# EAGLE design TestBench (EAGLE 6.1)
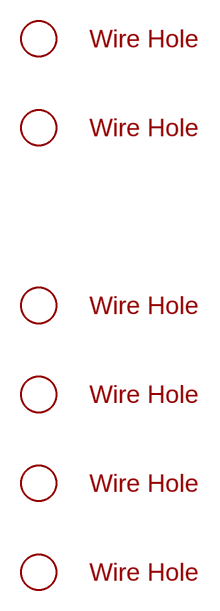
[diagram p0: schematic, sheet 1, part 1 of 2]
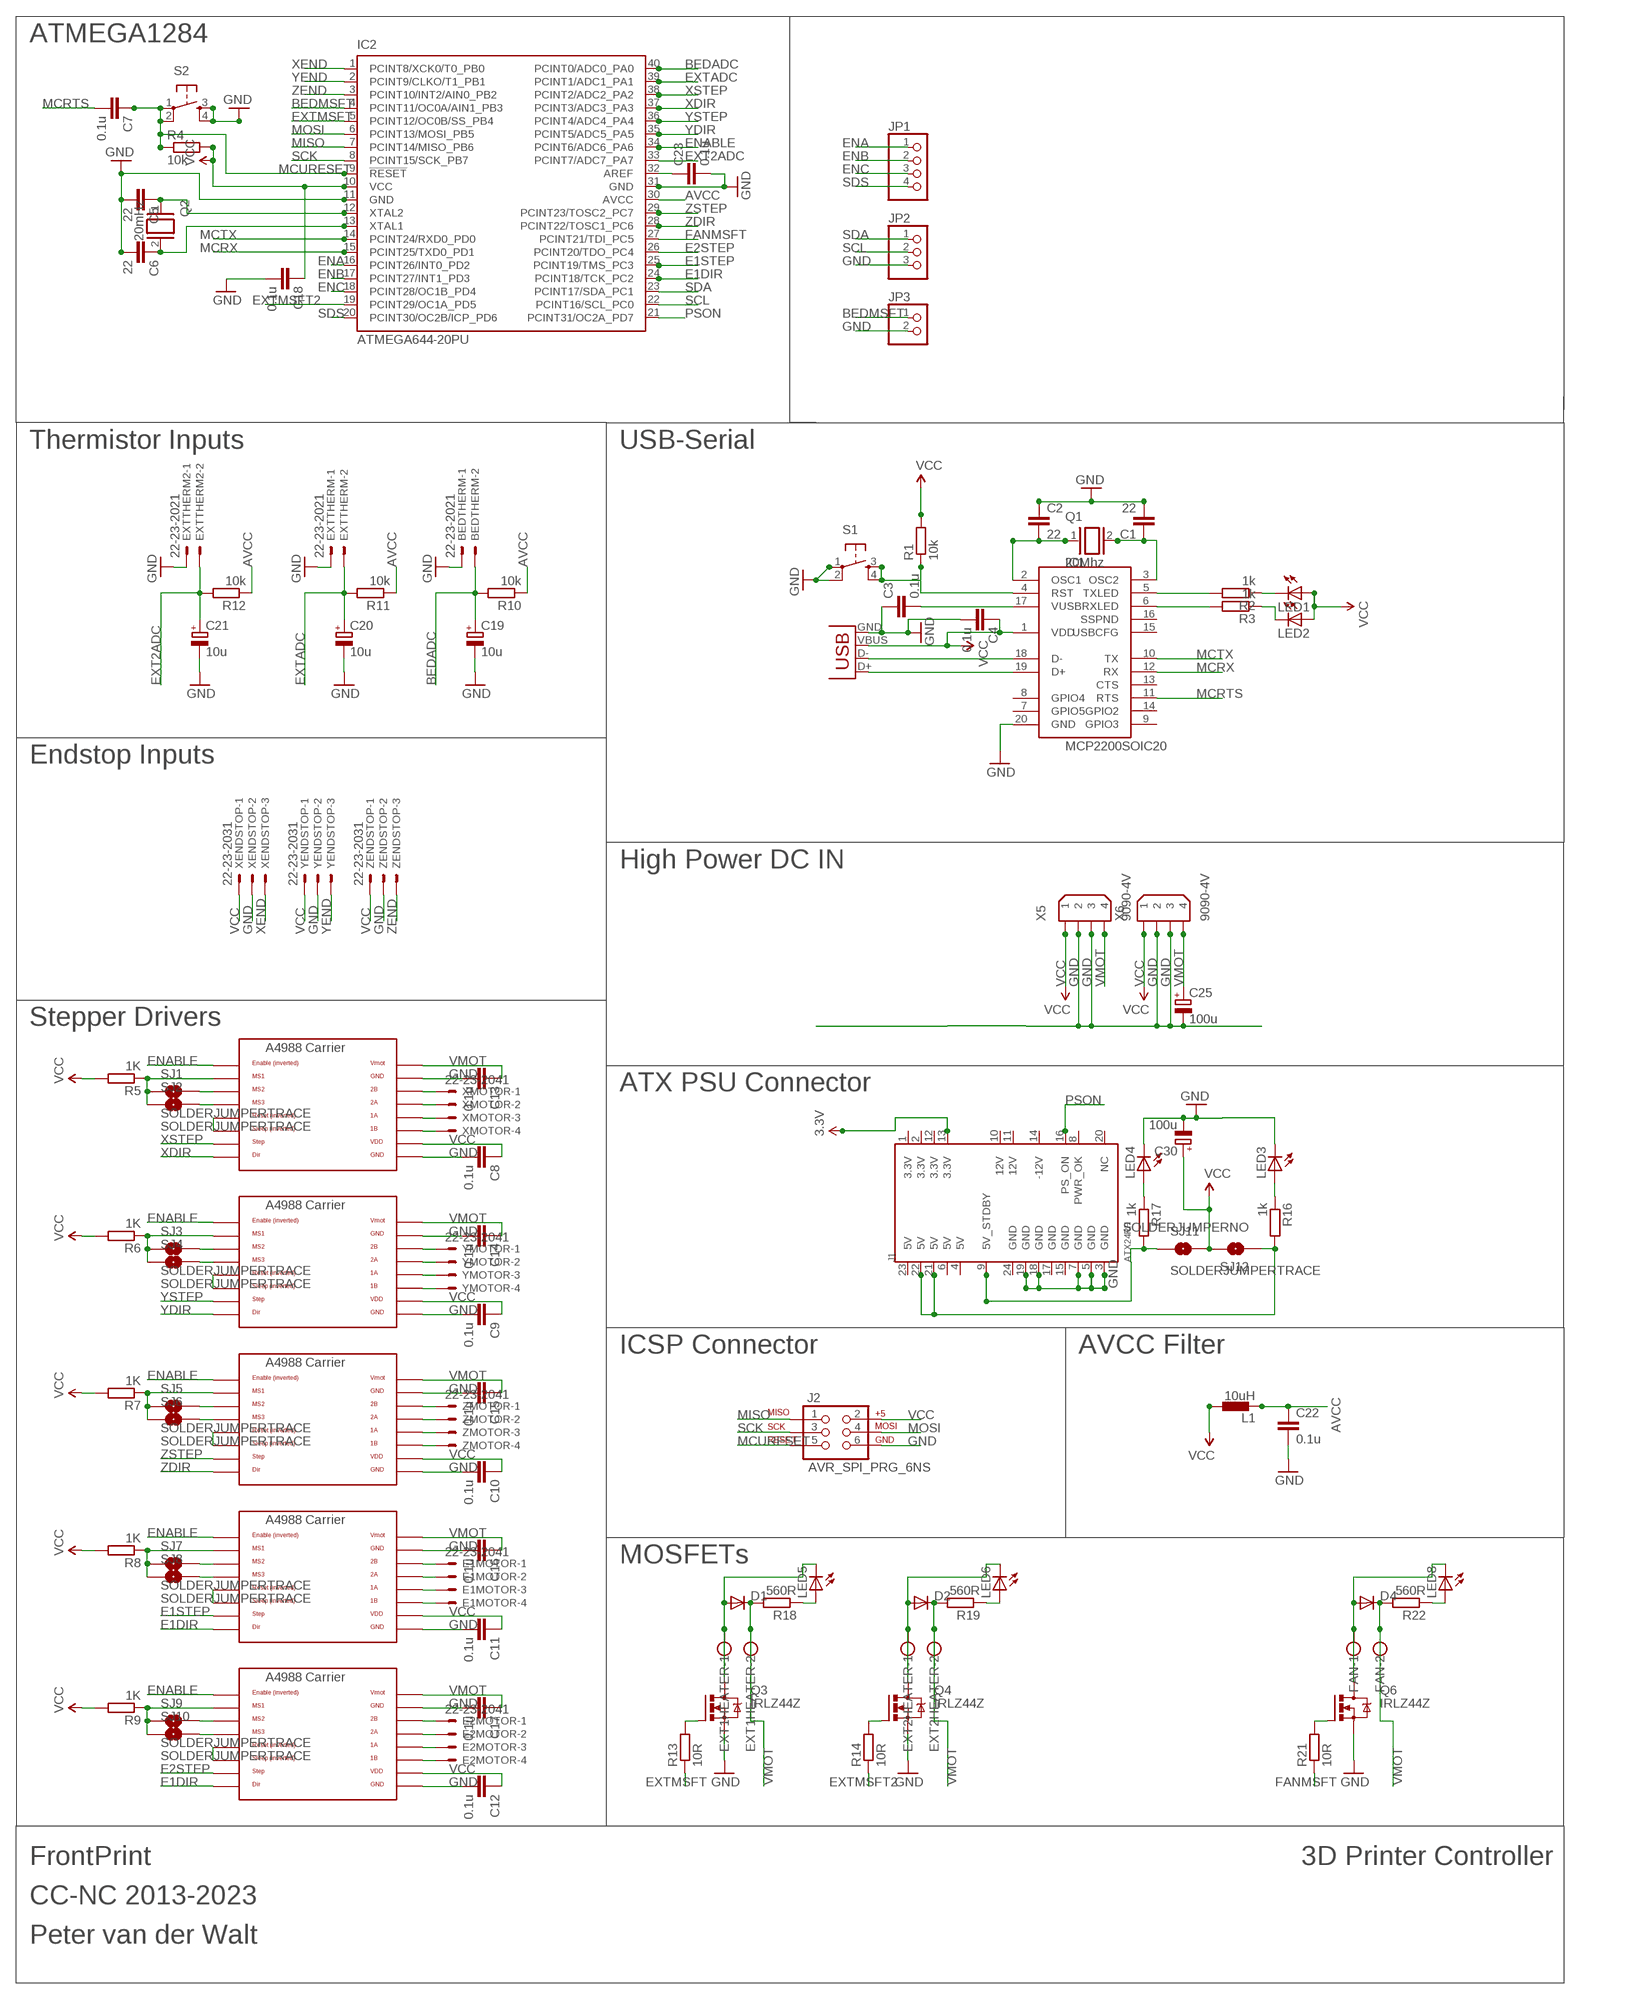
[diagram p1: schematic, sheet 1, part 2 of 2]

## Parts
BEDTHERM  22-23-2021  [22-23-2021]
C1  22  CAPKIT  [CAP-PTH-SMALL-KIT]
C2  22  CAPKIT  [CAP-PTH-SMALL-KIT]
C3  0.1u  CAPKIT  [CAP-PTH-SMALL-KIT]
C4  0.1u  CAPKIT  [CAP-PTH-SMALL-KIT]
C5  22  CAPKIT  [CAP-PTH-SMALL-KIT]
C6  22  CAPKIT  [CAP-PTH-SMALL-KIT]
C7  0.1u  CAPKIT  [CAP-PTH-SMALL-KIT]
C8  0.1u  CAPKIT  [CAP-PTH-SMALL-KIT]
C9  0.1u  CAPKIT  [CAP-PTH-SMALL-KIT]
C10  0.1u  CAPKIT  [CAP-PTH-SMALL-KIT]
C11  0.1u  CAPKIT  [CAP-PTH-SMALL-KIT]
C12  0.1u  CAPKIT  [CAP-PTH-SMALL-KIT]
C13  0.1u  CAPKIT  [CAP-PTH-SMALL-KIT]
C14  0.1u  CAPKIT  [CAP-PTH-SMALL-KIT]
C15  0.1u  CAPKIT  [CAP-PTH-SMALL-KIT]
C16  0.1u  CAPKIT  [CAP-PTH-SMALL-KIT]
C17  0.1u  CAPKIT  [CAP-PTH-SMALL-KIT]
C18  0.1u  CAPKIT  [CAP-PTH-SMALL-KIT]
C19  10u  CPOL-EUE2.5-5  [E2,5-5]
C20  10u  CPOL-EUE2.5-5  [E2,5-5]
C21  10u  CPOL-EUE2.5-5  [E2,5-5]
C22  0.1u  CAPKIT  [CAP-PTH-SMALL-KIT]
C23  0.1u  CAPKIT  [CAP-PTH-SMALL-KIT]
C25  100u  CPOL-EUE5-8.5  [E5-8,5]
C30  100u  CPOL-EUE5-8.5  [E5-8,5]
D1  DIODE1N4148  [DIODE-1N4148]
D2  DIODE1N4148  [DIODE-1N4148]
D4  DIODE1N4148  [DIODE-1N4148]
E1MOTOR  22-23-2041  [22-23-2041]
E2MOTOR  22-23-2041  [22-23-2041]
EPOLOLU  POLOLU_A4983CARRIER  [A4988BREAKOUT]
EPOLOLU2  POLOLU_A4983CARRIER  [A4988BREAKOUT]
EXT1HEATER  W237-102  [W237-102]
EXT2HEATER  W237-102  [W237-102]
EXTTHERM  22-23-2021  [22-23-2021]
EXTTHERM2  22-23-2021  [22-23-2021]
FAN  W237-102  [W237-102]
IC1  MCP2200SOIC20  [SOIC20]
IC2  ATMEGA644-20PU  [DIL40]
J1  ATX24RH  [ATX24_RIGHT_ANGLE]
J2  AVR_SPI_PRG_6NS  [2X3-NS]
JP1  PINHD-1X4  [1X04]
JP2  PINHD-1X3  [1X03]
JP3  PINHD-1X2  [1X02]
L1  10uH  BL01RN1A  [BL01RN1A]
LED1  LED3MM  [LED3MM]
LED2  LED3MM  [LED3MM]
LED3  LED3MM  [LED3MM]
LED4  LED3MM  [LED3MM]
LED5  LED3MM  [LED3MM]
LED6  LED3MM  [LED3MM]
LED8  LED3MM  [LED3MM]
Q1  20Mhz  XTAL/S  [QS]
Q2  20mHz  XTAL/S  [QS]
Q3  IRLZ44Z  [TO220BH]
Q4  IRLZ44Z  [TO220BH]
Q6  IRLZ44Z  [TO220BH]
R1  10k  R-EU_0204/7  [0204/7]
R2  1k  R-EU_0204/7  [0204/7]
R3  1k  R-EU_0204/7  [0204/7]
R4  10k  R-EU_0204/7  [0204/7]
R5  1K  R-EU_0204/7  [0204/7]
R6  1K  R-EU_0204/7  [0204/7]
R7  1K  R-EU_0204/7  [0204/7]
R8  1K  R-EU_0204/7  [0204/7]
R9  1K  R-EU_0204/7  [0204/7]
R10  10k  R-EU_0204/7  [0204/7]
R11  10k  R-EU_0204/7  [0204/7]
R12  10k  R-EU_0204/7  [0204/7]
R13  10R  R-EU_0204/7  [0204/7]
R14  10R  R-EU_0204/7  [0204/7]
R16  1k  R-EU_0204/7  [0204/7]
R17  1k  R-EU_0204/7  [0204/7]
R18  560R  R-EU_0204/7  [0204/7]
R19  560R  R-EU_0204/7  [0204/7]
R21  10R  R-EU_0204/7  [0204/7]
R22  560R  R-EU_0204/7  [0204/7]
S1  TAC_SWITCHPTH  [TACTILE-PTH]
S2  TAC_SWITCHPTH  [TACTILE-PTH]
SJ1  SOLDERJUMPERTRACE  [SJ_2S-TRACE]
SJ2  SOLDERJUMPERTRACE  [SJ_2S-TRACE]
SJ3  SOLDERJUMPERTRACE  [SJ_2S-TRACE]
SJ4  SOLDERJUMPERTRACE  [SJ_2S-TRACE]
SJ5  SOLDERJUMPERTRACE  [SJ_2S-TRACE]
SJ6  SOLDERJUMPERTRACE  [SJ_2S-TRACE]
SJ7  SOLDERJUMPERTRACE  [SJ_2S-TRACE]
SJ8  SOLDERJUMPERTRACE  [SJ_2S-TRACE]
SJ9  SOLDERJUMPERTRACE  [SJ_2S-TRACE]
SJ10  SOLDERJUMPERTRACE  [SJ_2S-TRACE]
SJ11  SOLDERJUMPERTRACE  [SJ_2S-TRACE]
SJ12  SOLDERJUMPERNO  [SJ_2S-NO]
U$1  3MMHOLE  [3MMHOLE]
U$3  3MMHOLE  [3MMHOLE]
U$5  3MMHOLE  [3MMHOLE]
U$6  3MMHOLE  [3MMHOLE]
U$7  3MMHOLE  [3MMHOLE]
U$8  3MMHOLE  [3MMHOLE]
X1  USBPTH  [USB-B-PTH]
X5  9090-4V  [9090-4V]
X6  9090-4V  [9090-4V]
XENDSTOP  22-23-2031  [22-23-2031]
XMOTOR  22-23-2041  [22-23-2041]
XPOLOLU  POLOLU_A4983CARRIER  [A4988BREAKOUT]
YENDSTOP  22-23-2031  [22-23-2031]
YMOTOR  22-23-2041  [22-23-2041]
YPOLOLU  POLOLU_A4983CARRIER  [A4988BREAKOUT]
ZENDSTOP  22-23-2031  [22-23-2031]
ZMOTOR  22-23-2041  [22-23-2041]
ZPOLOLU  POLOLU_A4983CARRIER  [A4988BREAKOUT]

## Nets
3.3V: J1.13(3.3V)
AVCC: C22.1 IC2.30(AVCC) L1.1 R10.1 R11.1 R12.1
BEDADC: BEDTHERM.2 C19.+ IC2.40(PCINT0/ADC0_PA0) R10.2
BEDMSFT: IC2.4(PCINT11/OC0A/AIN1_PB3) JP3.1
E1DIR: EPOLOLU2.DIR EPOLOLU.DIR IC2.24(PCINT18/TCK_PC2)
E1STEP: EPOLOLU.STEP IC2.25(PCINT19/TMS_PC3)
E2STEP: EPOLOLU2.STEP IC2.26(PCINT20/TDO_PC4)
ENA: IC2.16(PCINT26/INT0_PD2) JP1.1
ENABLE: EPOLOLU2.EN EPOLOLU.EN IC2.34(PCINT6/ADC6_PA6) XPOLOLU.EN YPOLOLU.EN ZPOLOLU.EN
ENB: IC2.17(PCINT27/INT1_PD3) JP1.2
ENC: IC2.18(PCINT28/OC1B_PD4) JP1.3
EXT2ADC: C21.+ EXTTHERM2.2 IC2.33(PCINT7/ADC7_PA7) R12.2
EXTADC: C20.+ EXTTHERM.2 IC2.39(PCINT1/ADC1_PA1) R11.2
EXTMSFT: IC2.5(PCINT12/OC0B/SS_PB4) R13.1
EXTMSFT2: IC2.19(PCINT29/OC1A_PD5) R14.1
FANMSFT: IC2.27(PCINT21/TDI_PC5) R21.1
GND: BEDTHERM.1 C1.2 C2.1 C3.1 C4.2 C5.2 C6.2 C8.2 C9.2 C10.2 C11.2 C12.2 C13.2 C14.2 C15.2 C16.2 C17.2 C18.2 C19.- C20.- C21.- C22.2 C23.2 C25.- C30.- EPOLOLU2.GND EPOLOLU2.GND@0(GND) EPOLOLU.GND EPOLOLU.GND@0(GND) EXTTHERM2.1 EXTTHERM.1 IC1.20(GND) IC2.11(GND) IC2.31(GND) J1.3(GND) J1.5(GND) J1.7(GND) J1.18(GND) J1.19(GND) J2.6 JP2.3 JP3.2 LED3.K(C) LED4.K(C) Q3.S Q4.S Q6.S S1.1 S1.2 S2.3 S2.4 X1.GND X5.2 X5.3 X6.2 X6.3 XENDSTOP.2 XPOLOLU.GND XPOLOLU.GND@0(GND) YENDSTOP.2 YPOLOLU.GND YPOLOLU.GND@0(GND) ZENDSTOP.2 ZPOLOLU.GND ZPOLOLU.GND@0(GND)
MCRTS: C7.2 IC1.11(RTS)
MCRX: IC1.12(RX) IC2.15(PCINT25/TXD0_PD1)
MCTX: IC1.10(TX) IC2.14(PCINT24/RXD0_PD0)
MCURESET: C7.1 IC2.9(!RESET) J2.5 R4.1 S2.1 S2.2
MISO: IC2.7(PCINT14/MISO_PB6) J2.1
MOSI: IC2.6(PCINT13/MOSI_PB5) J2.4
N$1: C2.2 IC1.2(OSC1) Q1.1
N$2: C1.1 IC1.3(OSC2) Q1.2
N$3: IC1.5(TXLED) R2.2
N$4: IC1.18(D-) X1.D-
N$5: IC1.19(D+) X1.D+
N$6: IC1.6(RXLED) R3.2
N$7: C3.2 IC1.17(VUSB)
N$8: Q3.G R13.2
N$9: LED1.K(C) R2.1
N$10: LED2.K(C) R3.1
N$11: C5.1 IC2.12(XTAL2) Q2.1
N$12: C6.1 IC2.13(XTAL1) Q2.2
N$13: IC1.4(RST) R1.1 S1.3 S1.4
N$14: R7.1 SJ5.1 SJ6.1 ZPOLOLU.MS1
N$15: SJ6.2 ZPOLOLU.MS3
N$16: SJ5.2 ZPOLOLU.MS2
N$17: EPOLOLU.MS2 SJ7.2
N$18: EPOLOLU.MS3 SJ8.2
N$19: EPOLOLU.MS1 R8.1 SJ7.1 SJ8.1
N$20: SJ3.2 YPOLOLU.MS2
N$21: SJ4.2 YPOLOLU.MS3
N$22: R6.1 SJ3.1 SJ4.1 YPOLOLU.MS1
N$23: SJ1.2 XPOLOLU.MS2
N$24: SJ2.2 XPOLOLU.MS3
N$25: R5.1 SJ1.1 SJ2.1 XPOLOLU.MS1
N$26: XPOLOLU.RST XPOLOLU.SLP(SLEEP)
N$27: YPOLOLU.RST YPOLOLU.SLP(SLEEP)
N$28: ZPOLOLU.RST ZPOLOLU.SLP(SLEEP)
N$29: EPOLOLU.RST EPOLOLU.SLP(SLEEP)
N$30: E1MOTOR.1 EPOLOLU.2B
N$31: E1MOTOR.2 EPOLOLU.2A
N$32: E1MOTOR.3 EPOLOLU.1A
N$33: E1MOTOR.4 EPOLOLU.1B
N$34: ZMOTOR.4 ZPOLOLU.1B
N$35: ZMOTOR.3 ZPOLOLU.1A
N$36: ZMOTOR.2 ZPOLOLU.2A
N$37: ZMOTOR.1 ZPOLOLU.2B
N$38: YMOTOR.4 YPOLOLU.1B
N$39: YMOTOR.3 YPOLOLU.1A
N$40: YMOTOR.2 YPOLOLU.2A
N$41: YMOTOR.1 YPOLOLU.2B
N$42: XMOTOR.4 XPOLOLU.1B
N$43: XMOTOR.3 XPOLOLU.1A
N$44: XMOTOR.2 XPOLOLU.2A
N$45: XMOTOR.1 XPOLOLU.2B
N$46: EPOLOLU2.MS2 SJ9.2
N$47: EPOLOLU2.MS3 SJ10.2
N$48: EPOLOLU2.MS1 R9.1 SJ9.1 SJ10.1
N$49: EPOLOLU2.RST EPOLOLU2.SLP(SLEEP)
N$50: E2MOTOR.1 EPOLOLU2.2B
N$51: E2MOTOR.2 EPOLOLU2.2A
N$52: E2MOTOR.3 EPOLOLU2.1A
N$53: E2MOTOR.4 EPOLOLU2.1B
N$54: C23.1 IC2.32(AREF)
N$55: D1.A EXT1HEATER.1 LED5.K(C) Q3.D
N$56: Q4.G R14.2
N$57: D2.A EXT2HEATER.1 LED6.K(C) Q4.D
N$60: J1.21(5V) J1.22(5V) R16.2 SJ12.1
N$61: LED5.A R18.1
N$62: J1.9(5V_STDBY) R17.2 SJ11.1
N$63: LED4.A R17.1
N$64: LED3.A R16.1
N$65: Q6.G R21.2
N$66: LED6.A R19.1
N$67: D4.A FAN.1 LED8.K(C) Q6.D
N$69: LED8.A R22.1
PSON: IC2.21(PCINT31/OC2A_PD7) J1.16(PS_ON)
SCK: IC2.8(PCINT15/SCK_PB7) J2.3
SCL: IC2.22(PCINT16/SCL_PC0) JP2.2
SDA: IC2.23(PCINT17/SDA_PC1) JP2.1
SDS: IC2.20(PCINT30/OC2B/ICP_PD6) JP1.4
VCC: C4.1 C8.1 C9.1 C10.1 C11.1 C12.1 C18.1 C30.+ EPOLOLU2.VDD EPOLOLU.VDD IC1.1(VDD) IC2.10(VCC) J2.2 L1.2 LED1.A LED2.A R1.2 R4.2 R5.2 R6.2 R7.2 R8.2 R9.2 SJ11.2 SJ12.2 X1.VBUS X5.1 X6.1 XENDSTOP.1 XPOLOLU.VDD YENDSTOP.1 YPOLOLU.VDD ZENDSTOP.1 ZPOLOLU.VDD
VMOT: C13.1 C14.1 C15.1 C16.1 C17.1 C25.+ D1.C D2.C D4.C EPOLOLU2.VMOT EPOLOLU.VMOT EXT1HEATER.2 EXT2HEATER.2 FAN.2 R18.2 R19.2 R22.2 X5.4 X6.4 XPOLOLU.VMOT YPOLOLU.VMOT ZPOLOLU.VMOT
XDIR: IC2.37(PCINT3/ADC3_PA3) XPOLOLU.DIR
XEND: IC2.1(PCINT8/XCK0/T0_PB0) XENDSTOP.3
XSTEP: IC2.38(PCINT2/ADC2_PA2) XPOLOLU.STEP
YDIR: IC2.35(PCINT5/ADC5_PA5) YPOLOLU.DIR
YEND: IC2.2(PCINT9/CLKO/T1_PB1) YENDSTOP.3
YSTEP: IC2.36(PCINT4/ADC4_PA4) YPOLOLU.STEP
ZDIR: IC2.28(PCINT22/TOSC1_PC6) ZPOLOLU.DIR
ZEND: IC2.3(PCINT10/INT2/AIN0_PB2) ZENDSTOP.3
ZSTEP: IC2.29(PCINT23/TOSC2_PC7) ZPOLOLU.STEP
Unconnected: IC1.7(GPIO5) IC1.8(GPIO4) IC1.9(GPIO3) IC1.13(CTS) IC1.14(GPIO2) IC1.15(USBCFG) IC1.16(SSPND) J1.1(3.3V) J1.2(3.3V) J1.4(5V) J1.6(5V) J1.8(PWR_OK) J1.10(12V) J1.11(12V) J1.12(3.3V) J1.14(-12V) J1.15(GND) J1.17(GND) J1.20(NC) J1.23(5V) J1.24(GND)

## Notes on the sheet
- ATMEGA1284
- Thermistor Inputs | USB-Serial
- Endstop Inputs
- High Power DC IN
- Stepper Drivers
- ATX PSU Connector
- ICSP Connector | AVCC Filter
- MOSFETs
- FrontPrint | 3D Printer Controller
- CC-NC 2013-2023
- Peter van der Walt

## Library data of the parts
BEDTHERM EXTTHERM EXTTHERM2 = con-molex:22-23-2021: .100" (2.54mm) Center Header - 2 Pin; MF: MOLEX; MPN: 22-23-2021; OC_FARNELL: 1462926; OC_NEWARK: 25C3832
C1-C18 C22 C23 = SparkFun-Passives:CAP: Capacitor Standard 0603 ceramic capacitor, and 0.1" leaded capacitor.
C19-C21 C25 C30 = rcl:CPOL-EU: POLARIZED CAPACITOR, European symbol
D1 D2 D4 = SparkFun-DiscreteSemi:DIODE: Diode These are standard reverse protection diodes and small signal diodes. SMA package can handle up to about 1A. SOD-323 can handle about 200mA. What the SOD-323 package when ordering, there are some mfgs out there that are 5-pin packages.
E1MOTOR E2MOTOR XMOTOR YMOTOR ZMOTOR = con-molex:22-23-2041: .100" (2.54mm) Center Header - 4 Pin; MF: MOLEX; MPN: 22-23-2041; OC_FARNELL: 1462920; OC_NEWARK: 38C0355
EPOLOLU EPOLOLU2 XPOLOLU YPOLOLU ZPOLOLU = RepRapjr:POLOLU_A4983CARRIER
EXT1HEATER EXT2HEATER FAN = con-wago-500:W237-102: WAGO SCREW CLAMP; MPN: 237-102; OC_FARNELL: unknown; OC_NEWARK: 70K9898
IC1 = microchip-update-2:MCP2200: USB 2.0 to UART Protocol Converter with GPIO
IC2 = atmel:ATMEGA644-*PU: 8-bit Microcontroller with 64K Bytes In-System Programmable Flash Auto generated by make-symbol-device-package-bsdl.ulp Rev. 34 Source: http://www.atmel.com/dyn/resources/prod_documents/doc2593.pdf; MPN: ATMEGA644-20PU; OC_FARNELL: 1288340; OC_NEWARK: 23M5060
J1 = SparkFun-Connectors:ATX24: ATX24 Pin Power Supply Connector This is a good connector for connecting a computer power supply to a PCB. It's massive, but provides many amps of power at 5V and 12V. SKU: PRT-09498
J2 = SparkFun-Connectors:AVR_SPI_PRG_6: AVR ISP 6 Pin This is the reduced ISP connector for AVR programming. Common on Arduino. This footprint will take up less PCB space and can be used with a 10-pin to 6-pin adapter such as SKU: BOB-08508
JP1 = pinhead:PINHD-1X4: PIN HEADER
JP2 = pinhead:PINHD-1X3: PIN HEADER
JP3 = pinhead:PINHD-1X2: PIN HEADER
L1 = inductors:BL0: Noise Suppression Products/EMI Suppression Filters, Lead EMIFIL(R) Inductor Type Source: http://www.murata.com .. BL01RN1_DS.pdf
LED1-LED6 LED8 = led:LED: LED OSRAM: - CHIPLED LG R971, LG N971, LY N971, LG Q971, LY Q971, LO R971, LY R971 LH N974, LH R974 LS Q976, LO Q976, LY Q976 LO Q996 - Hyper CHIPLED LW Q18S LB Q993, LB Q99A, LB R99A - SideLED LS A670, LO A670, LY A670, LG A670, LP A670 LB A673, LV A673, LT A673, LW A673 LH A674 LY A675 LS A676, LA A676, LO A676, LY A676, LW A676 LS A679, LY A679, LG A679 - Hyper Micro SIDELED® LS Y876, LA Y876, LO Y876, LY Y876 LT Y87S - SmartLED LW L88C, LW L88S LB L89C, LB L89S, LG L890 LS L89K, LO L89K, LY L89K LS L896, LA L896, LO L896, LY L896 - TOPLED LS T670, LO T670, LY T670, LG T670, LP T670 LSG T670, LSP T670, LSY T670, LOP T670, LYG T670 LG T671, LOG T671, LSG T671 LB T673, LV T673, LT T673, LW T673 LH T674 LS T676, LA T676, LO T676, LY T676, LB T676, LH T676, LSB T676, LW T676 LB T67C, LV T67C, LT T67C, LS T67K, LO T67K, LY T67K, LW E67C LS E67B, LA E67B, LO E67B, LY E67B, LB E67C, LV E67C, LT E67C LW T67C LS T679, LY T679, LG T679 LS T770, LO T770, LY T770, LG T770, LP T770 LB T773, LV T773, LT T773, LW T773 LH T774 LS E675, LA E675, LY E675, LS T675 LS T776, LA T776, LO T776, LY T776, LB T776 LHGB T686 LT T68C, LB T68C - Hyper Mini TOPLED® LB M676 - Mini TOPLED Santana® LG M470 LS M47K, LO M47K, LY M47K Source: http://www.osram.convergy.de LUXEON: - LUMILED® LXK2-PW12-R00, LXK2-PW12-S00, LXK2-PW14-U00, LXK2-PW14-V00 LXK2-PM12-R00, LXK2-PM12-S00, LXK2-PM14-U00 LXK2-PE12-Q00, LXK2-PE12-R00, LXK2-PE12-S00, LXK2-PE14-T00, LXK2-PE14-U00 LXK2-PB12-K00, LXK2-PB12-L00, LXK2-PB12-M00, LXK2-PB14-N00, LXK2-PB14-P00, LXK2-PB14-Q00 LXK2-PR12-L00, LXK2-PR12-M00, LXK2-PR14-Q00, LXK2-PR14-R00 LXK2-PD12-Q00, LXK2-PD12-R00, LXK2-PD12-S00 LXK2-PH12-R00, LXK2-PH12-S00 LXK2-PL12-P00, LXK2-PL12-Q00, LXK2-PL12-R00 Source: www.luxeon.com KINGBRIGHT: KA-3528ASYC Source: www.kingbright.com
Q1 Q2 = special:XTAL/S: CRYSTAL
Q3 Q4 Q6 = transistor-power:IRLZ44Z: N-Channel HEXFET® Power MOSFET Logic Level AUTOMOTIVE MOSFET Source: http://www.irf.com/product-info/datasheets/data/irlz44zpbf.pdf
R1-R14 R16-R19 R21 R22 = resistor:R-EU_: RESISTOR, European symbol
S1 S2 = SparkFun-Electromechanical:TAC_SWITCH: Momentary Switch Button commonly used for reset or general input. Spark Fun Electronics SKU : COM-00097
SJ1-SJ12 = SparkFun-Passives:SOLDERJUMPER: Solder Jumper Standard SMD solder jumper. Used to automate production. Two varients : Normally Open and Normally Closed are the same, but have different paste layers. NC will have a large amount of paste and should jumper during reflow.
U$1 U$3 U$5-U$8 = reprap:3MMHOLE
X1 = SparkFun-Connectors:USB: USB Connectors USB-B-PTH is fully proven SKU : PRT-00139 USB-miniB is fully proven SKU : PRT-00587 USB-A-PCB is untested. USB-A-H is throughly reviewed, but untested. Spark Fun Electronics SKU : PRT-00437 USB-B-SMT is throughly reviewed, but untested. Needs silkscreen touching up. USB-A-S has not been used/tested USB-MB-H has not been used/tested
X5 X6 = con-thomas-betts:9090-4: Disk Drive Power four position Source: Thomas & Betts Electronic Interconnects Eiropean Edition 1998; OC_FARNELL: unknown; OC_NEWARK: unknown
XENDSTOP YENDSTOP ZENDSTOP = con-molex:22-23-2031: .100" (2.54mm) Center Header - 3 Pin; MF: MOLEX; MPN: 22-23-2031; OC_FARNELL: 1462950; OC_NEWARK: 30C0862

## Board
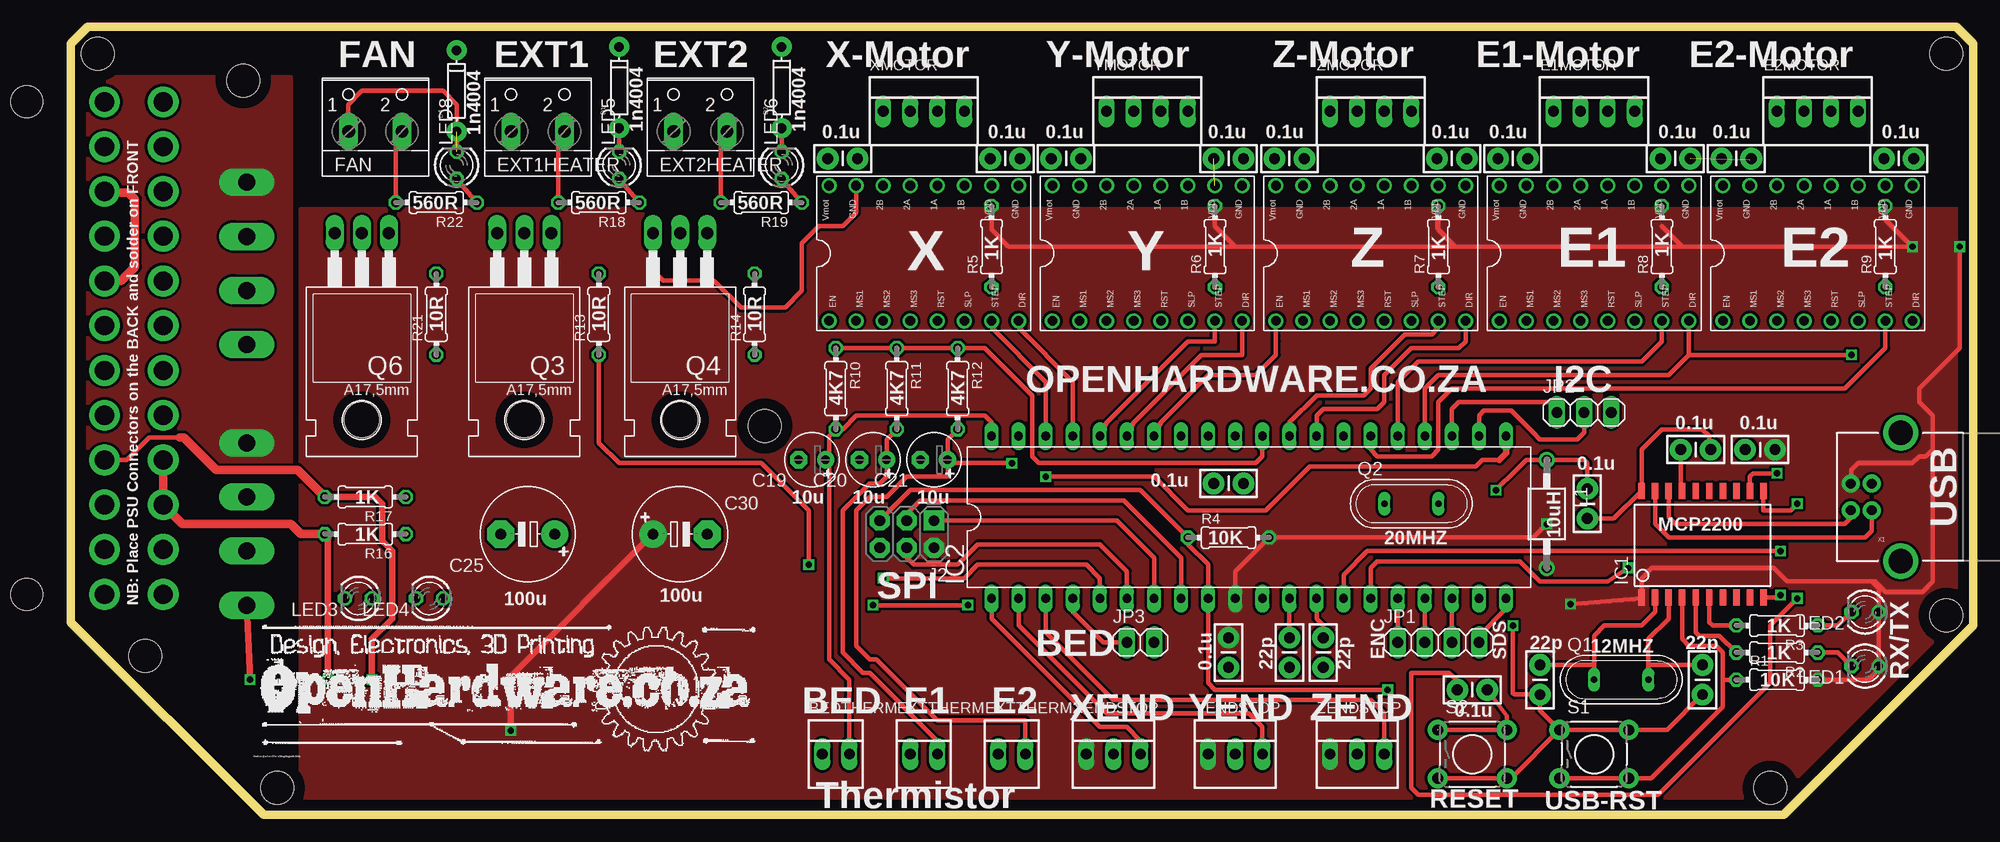
[diagram p2: board, top side]
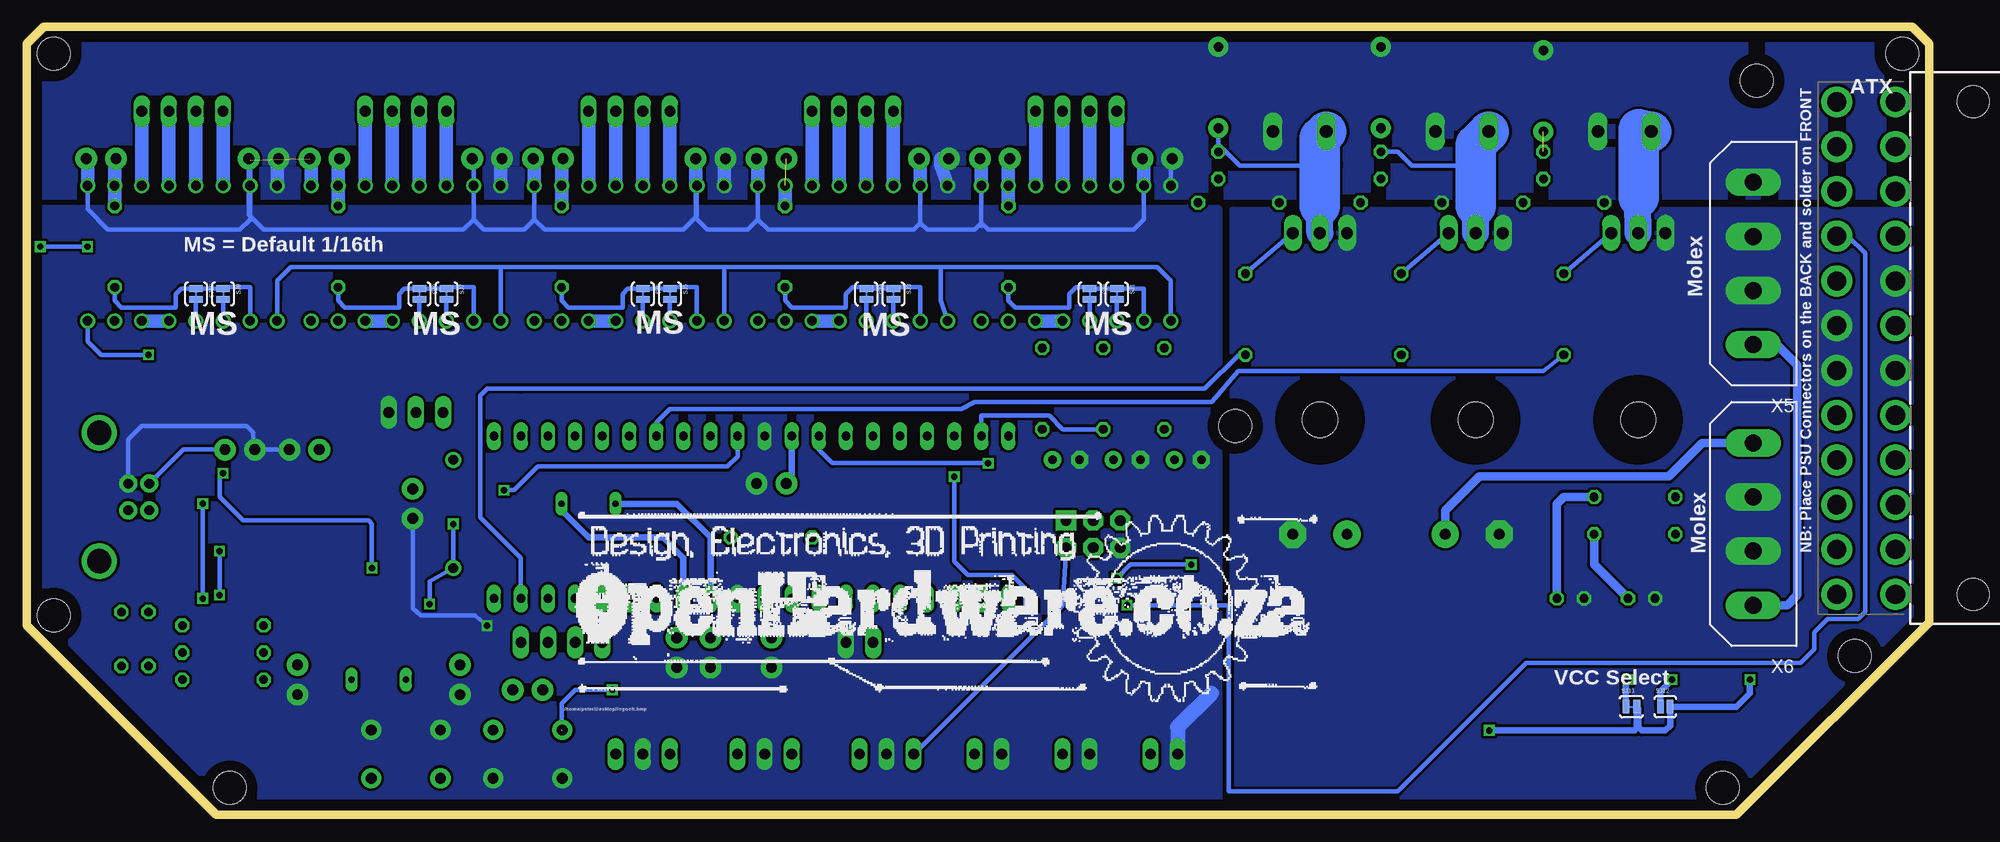
[diagram p3: board, bottom side, seen from below]

Size 178.44 x 73.98 mm. Coordinates in mm from the lower left corner, seen from the top.
Outline: 0,72.39 0,18.1 18.1,0 160.65,0 178.43,17.78 178.43,72.39 176.85,73.98 1.59,73.98 0,72.39
Copper layers (1*16): Top 0.035mm / dielectric 1.5mm / Bottom 0.035mm
Design rules: minimum track width 10mil, minimum drill 20mil, track to track 10mil, track to pad 10mil, pad to pad 10mil, via to via 10mil, smd to smd 10mil, copper to edge 40mil, drill to drill 8mil, minimum pad ring 10mil, minimum via ring 8mil, stop-mask expansion 1mil, vias tented up to drill 0mil, thermal gap 0mil

### Footprints (pad centres in the part's own frame; a part is rotated, then mirrored left to right if it is on the bottom)
22-23-2021 = drill 1 long: 1 -1.27,0; 2 1.27,0
CAP-PTH-SMALL-KIT = drill 1.016 pad 2.032: 1 -1.397,0; 2 1.397,0
E2,5-5 = drill 0.813 pad 1.6: + -1.27,0 | drill 0.813 pad 1.6 octagon: - 1.27,0
E5-8,5 = drill 1.016 pad 2.54: + -2.54,0 | drill 1.016 pad 2.54 octagon: - 2.54,0
DIODE-1N4148 = drill 0.9 pad 1.88: A -3.81,0; C 3.81,0
22-23-2041 = drill 1 long: 1 -3.81,0; 2 -1.27,0; 3 1.27,0; 4 3.81,0
A4988BREAKOUT = drill 0.9: 1A 8.89,1.27; 1B 11.43,1.27; 2A 6.35,1.27; 2B 3.81,1.27; DIR 16.51,-11.43; EN -1.27,-11.43; GND 16.51,1.27; GND@0 1.27,1.27; MS1 1.27,-11.43; MS2 3.81,-11.43; MS3 6.35,-11.43; RST 8.89,-11.43; SLP 11.43,-11.43; STEP 13.97,-11.43; VDD 13.97,1.27; VMOT -1.27,1.27
W237-102 = drill 1.194 long: 1 -2.5,-1.27; 2 2.5,-1.27
SOIC20 = smd 0.6 x 1.5: 1 -5.715,-5; 2 -4.445,-5; 3 -3.175,-5; 4 -1.905,-5; 5 -0.635,-5; 6 0.635,-5; 7 1.905,-5; 8 3.175,-5; 9 4.445,-5; 10 5.715,-5; 11 5.715,5; 12 4.445,5; 13 3.175,5; 14 1.905,5; 15 0.635,5; 16 -0.635,5; 17 -1.905,5; 18 -3.175,5; 19 -4.445,5; 20 -5.715,5
DIL40 = drill 0.813 long: 1 -24.13,-7.62; 2 -21.59,-7.62; 3 -19.05,-7.62; 4 -16.51,-7.62; 5 -13.97,-7.62; 6 -11.43,-7.62; 7 -8.89,-7.62; 8 -6.35,-7.62; 9 -3.81,-7.62; 10 -1.27,-7.62; 11 1.27,-7.62; 12 3.81,-7.62; 13 6.35,-7.62; 14 8.89,-7.62; 15 11.43,-7.62; 16 13.97,-7.62; 17 16.51,-7.62; 18 19.05,-7.62; 19 21.59,-7.62; 20 24.13,-7.62; 21 24.13,7.62; 22 21.59,7.62; 23 19.05,7.62; 24 16.51,7.62; 25 13.97,7.62; 26 11.43,7.62; 27 8.89,7.62; 28 6.35,7.62; 29 3.81,7.62; 30 1.27,7.62; 31 -1.27,7.62; 32 -3.81,7.62; 33 -6.35,7.62; 34 -8.89,7.62; 35 -11.43,7.62; 36 -13.97,7.62; 37 -16.51,7.62; 38 -19.05,7.62; 39 -21.59,7.62; 40 -24.13,7.62
ATX24_RIGHT_ANGLE = drill 1.8 pad 2.9: 1 23.1,4.76; 2 18.9,4.76; 3 14.7,4.76; 4 10.5,4.76; 5 6.3,4.76; 6 2.1,4.76; 7 -2.1,4.76; 8 -6.3,4.76; 9 -10.5,4.76; 10 -14.7,4.76; 11 -18.9,4.76; 12 -23.1,4.76; 13 23.1,10.26; 14 18.9,10.26; 15 14.7,10.26; 16 10.5,10.26; 17 6.3,10.26; 18 2.1,10.26; 19 -2.1,10.26; 20 -6.3,10.26; 21 -10.5,10.26; 22 -14.7,10.26; 23 -18.9,10.26; 24 -23.1,10.26 | hole 3: -23.1,-2.54; 23.1,-2.54
2X3-NS = drill 1.016 pad 1.88 square: 1 -2.54,-1.27 | drill 1.016 pad 1.88 octagon: 2 -2.54,1.27; 3 0,-1.27; 4 0,1.27; 5 2.54,-1.27; 6 2.54,1.27
1X04 = drill 1.016 long: 1 -3.81,0; 2 -1.27,0; 3 1.27,0; 4 3.81,0
1X03 = drill 1.016 long: 1 -2.54,0; 2 0,0; 3 2.54,0
1X02 = drill 1.016 long: 1 -1.27,0; 2 1.27,0
BL01RN1A = drill 0.9 pad 1.5: 1 -5.08,0; 2 5.08,0
LED3MM = drill 0.813 octagon: A -1.27,0; K 1.27,0
QS = drill 0.61 long: 1 -2.54,0; 2 2.54,0
TO220BH = drill 1.118 long: D 0,-6.35; G -2.54,-6.35; S 2.54,-6.35 | hole 3.302: 0,11.176
0204/7 = drill 0.813 octagon: 1 -3.81,0; 2 3.81,0
TACTILE-PTH = drill 1.016 pad 1.88: 1 -3.251,2.261; 2 3.251,2.261; 3 -3.251,-2.261; 4 3.251,-2.261
SJ_2S-TRACE = smd 0.635 x 1.27: 1 -0.508,0; 2 0.508,0
SJ_2S-NO = smd 0.635 x 1.27: 1 -0.45,0; 2 0.45,0
3MMHOLE = hole 3.1: 0,0
USB-B-PTH = drill 0.914 pad 1.676: D+ 0,1.25; D- 1.981,1.25; GND 0,-1.25; VBUS 1.981,-1.25 | drill 2.286: S1 -2.718,-6.02; S2 -2.718,6.02
9090-4V = drill 1.6 pad 2.6 long: 1 -7.62,0; 2 -2.54,0; 3 2.54,0; 4 7.62,0
22-23-2031 = drill 1 long: 1 -2.54,0; 2 0,0; 3 2.54,0

### Placement (x,y rotation side)
BEDTHERM  71.75,5.71 0 top
C1  153.03,12.7 270 top
C2  137.79,12.7 90 top
C3  152.4,34.29 180 top
C4  158.43,34.29 180 top
C5  114.3,15.24 270 top
C6  117.47,15.24 270 top
C7  131.44,11.75 180 top
C8  108.58,61.59 0 top
C9  87.63,61.59 0 top
C10  171.45,61.59 0 top
C11  150.5,61.59 0 top
C12  129.54,61.59 0 top
C13  135.25,61.59 0 top
C14  93.34,61.59 0 top
C15  156.21,61.59 0 top
C16  114.3,61.59 0 top
C17  72.39,61.59 0 top
C18  108.58,15.24 270 top
C19  69.53,33.34 180 top
C20  75.25,33.34 180 top
C21  80.96,33.34 180 top
C22  142.24,29.21 270 top
C23  108.58,31.11 0 top
C25  42.86,26.35 180 top
C30  57.15,26.35 0 top
D1  51.44,68.26 90 top
D2  66.67,68.26 90 top
D4  36.19,67.94 90 top
E1MOTOR  142.88,66.04 0 top
E2MOTOR  163.83,66.04 0 top
EPOLOLU  135.25,57.78 0 top
EPOLOLU2  156.21,57.78 0 top
EXT1HEATER  43.81,65.4 0 top
EXT2HEATER  59.06,65.4 0 top
EXTTHERM  80.01,5.71 0 top
EXTTHERM2  88.26,5.71 0 top
FAN  28.57,65.4 0 top
IC1  153.03,25.4 0 top
IC2  110.49,27.94 0 top
J1  -1.59,43.81 90 bottom
J2  78.42,26.35 180 top
JP1  128.27,16.19 0 top
JP2  141.92,37.78 0 top
JP3  100.33,16.19 0 top
L1  138.43,28.26 270 top
LED1  168.27,13.97 180 top
LED2  168.27,19.05 180 top
LED3  26.99,20.32 180 top
LED4  33.66,20.32 180 top
LED5  51.44,60.96 90 top
LED6  66.67,60.96 90 top
LED8  36.19,60.96 90 top
Q1  145.41,12.7 0 top
Q2  125.73,29.21 0 top
Q3  42.54,48.26 180 top
Q4  57.15,48.26 180 top
Q6  27.31,48.26 180 top
R1  160.02,12.7 0 top
R2  160.02,15.24 180 top
R3  160.02,17.78 180 top
R4  108.58,26.03 0 top
R5  86.36,53.34 90 top
R6  107.31,53.34 90 top
R7  128.27,53.34 90 top
R8  149.22,53.34 90 top
R9  170.18,53.34 90 top
R10  71.75,40 270 top
R11  77.47,40 270 top
R12  83.19,40 270 top
R13  49.53,46.99 90 top
R14  64.13,46.99 90 top
R16  27.62,26.35 180 top
R17  27.62,29.84 180 top
R18  49.53,57.47 180 top
R19  64.77,57.47 180 top
R21  34.29,46.99 90 top
R22  34.29,57.47 180 top
S1  142.88,5.71 0 top
S2  131.44,5.71 0 top
SJ1  76.2,48.89 270 bottom
SJ2  78.74,48.89 270 bottom
SJ3  97.16,48.89 270 bottom
SJ4  99.69,48.89 270 bottom
SJ5  118.11,48.89 270 bottom
SJ6  120.65,48.89 270 bottom
SJ7  139.06,48.89 270 bottom
SJ8  141.6,48.89 270 bottom
SJ9  160.02,48.89 270 bottom
SJ10  162.56,48.89 270 bottom
SJ11  27.94,10.16 0 bottom
SJ12  24.76,10.16 0 bottom
U$1  16.19,68.9 0 top
U$2  3MMHOLE  [3MMHOLE]  2.54,71.44 0 top
U$3  65.09,36.51 0 top
U$4  3MMHOLE  [3MMHOLE]  19.37,2.54 0 top
U$5  159.38,2.54 0 top
U$6  175.89,18.73 0 top
U$7  6.98,14.92 0 top
U$8  175.89,71.44 0 top
X1  168.91,29.84 180 top
X5  16.51,51.75 90 bottom
X6  16.51,27.3 90 bottom
XENDSTOP  97.79,5.71 0 top
XMOTOR  80.01,66.04 0 top
XPOLOLU  72.39,57.78 0 top
YENDSTOP  109.22,5.71 0 top
YMOTOR  100.97,66.04 0 top
YPOLOLU  93.34,57.78 0 top
ZENDSTOP  120.65,5.71 0 top
ZMOTOR  121.92,66.04 0 top
ZPOLOLU  114.3,57.78 0 top

### Tracks (layer width: path | path; a pad name or v marks a point on that pad's centre or on a via)
AVCC  (via drill 0.6)
  Top 0.406: IC2.30 111.76,33.65 111.12,33.02 90.8,33.02 90.17,33.65 90.17,39.37 85.72,43.81 R12.1 R11.1 R10.1 | v133.67,30.48 135.57,32.38 136.52,33.34 L1.1 141.92,33.34 142.24,33.02 C22.1
  Bottom 0.406: v133.67,30.48 132.71,30.48 130.49,32.7 112.71,32.7 111.76,33.65 IC2.30
BEDADC
  Top 0.406: IC2.40 86.36,36.83 85.72,37.46 73.66,37.46 72.39,36.19 R10.2 71.12,35.56 71.12,33.34 | BEDTHERM.2 73.02,12.7 71.12,14.6 71.12,29.84 71.12,33.34 | 71.12,33.34 C19.+
BEDMSFT
  Top 0.406: IC2.4 93.98,19.05 96.84,16.19 98.74,16.19 JP3.1
E1DIR  (via drill 0.6)
  Top 0.406: IC2.24 127,40 128.27,41.27 149.86,41.27 151.76,43.18 | 151.76,43.18 EPOLOLU.DIR 151.76,43.18 | 151.76,43.18 v167,43.18
  Bottom 0.406: v167,43.18 171.45,43.18 172.72,44.45 EPOLOLU2.DIR
E1STEP
  Top 0.406: IC2.25 124.46,40.64 126.36,42.54 147.32,42.54 149.22,44.45 EPOLOLU.STEP
E2STEP
  Top 0.406: IC2.26 121.92,34.29 122.55,33.65 127.63,33.65 128.27,34.29 128.27,38.73 129.54,40 166.37,40 170.18,43.81 EPOLOLU2.STEP
ENA
  Top 0.406: JP1.1 IC2.16
ENABLE
  Top 0.406: IC2.34 102.23,36.83 106.68,41.27 110.49,41.27 111.12,41.27 113.03,43.18 113.03,44.45 ZPOLOLU.EN
  Bottom 0.406: EPOLOLU.EN 133.98,48.26 133.98,51.43 | EPOLOLU2.EN 154.94,48.26 154.94,50.16 153.67,51.43 133.98,51.43 | 113.03,48.26 ZPOLOLU.EN 113.03,51.43 | YPOLOLU.EN 92.71,48.26 92.71,51.43 | 71.12,47.62 XPOLOLU.EN 71.12,50.16 72.39,51.43 92.71,51.43 | 92.71,51.43 113.03,51.43 | 113.03,51.43 133.98,51.43
ENB
  Top 0.406: JP1.2 IC2.17
ENC
  Top 0.406: JP1.3 IC2.18
EXT2ADC  (via drill 0.6)
  Top 0.406: v88.26,33.02 86.36,33.02 82.55,33.02 C21.+ | EXTTHERM2.2 89.53,8.89 81.28,8.89 75.56,14.6 74.93,14.6 73.66,15.87 73.66,28.57 74.93,29.84 76.52,29.84 78.42,31.75 80.01,31.75 82.23,31.75 C21.+ | C21.+ 82.23,35.24 R12.2
  Bottom 0.406: v88.26,33.02 102.87,33.02 104.14,34.29 IC2.33
EXTADC
  Top 0.406: EXTTHERM.2 81.28,6.98 74.93,13.33 74.29,13.33 72.39,15.24 72.39,28.57 74.93,31.11 75.88,31.11 76.52,31.75 C20.+ 76.52,35.24 R11.2
  Bottom 0.406: R11.2 81.28,36.19 82.55,37.46 83.18,37.46 88.9,37.46 IC2.39
EXTMSFT  (via drill 0.6)
  Top 0.406: R13.1 49.53,34.92 51.43,33.02 64.77,33.02 69.21,28.57 v69.21,23.49 | v76.2,22.22 83.82,22.22 85.09,23.49 95.25,23.49 96.52,22.22 IC2.5
  Bottom 0.406: v69.21,23.49 74.93,23.49 v76.2,22.22
EXTMSFT2
  Bottom 0.406: R14.1 64.77,43.18 67.94,40 132.08,40 135.25,40 135.89,39.37 135.89,36.83 135.89,27.94 132.08,24.13 IC2.19
FANMSFT
  Bottom 0.406: IC2.27 119.38,36.83 118.11,38.1 90.8,38.1 89.53,38.73 67.31,38.73 64.8,41.66 36.23,41.66 R21.1
GND  (via drill 0.6)  (1 unrouted)
  Top 0.406: S1.1 137.79,9.8 C2.1 135.38,11.3 135.25,11.43 135.25,16.19 v135.25,17.78 | S1.1 S1.2 149.71,7.98 C1.2 | S1.1 135.1,3.45 S2.4 S2.3 | C22.2 144.73,27.81 IC1.20 147.32,34.29 149.22,36.19 153.03,36.19 153.67,35.56 153.67,34.42 C3.1 | Q4.S 54.61,51.12 55.56,50.16 60.32,50.16 62.86,47.62 66.99,47.62 68.58,49.21 68.58,53.66 70.17,55.24 72.39,55.24 73.66,56.51 XPOLOLU.GND@0
  Top 0.813: J1.5 4.71,50.11 6.03,51.43 6.03,57.78 5.4,58.42 3.27,58.42 J1.3
  Bottom 0.406: 151.76,61.59 151.76,62.23 | X1.GND 168.91,35.24 167.64,36.51 157.8,36.51 157.16,35.88 157.16,34.42 C4.2 C3.1 | C22.2 142.21,19.4 141.48,18.73 136.4,18.73 v135.25,17.78 | 172.72,61.59 172.72,56.83 170.81,54.93 158.43,54.93 157.48,55.88 EPOLOLU2.GND@0 157.48,61.47 C15.2 157.61,56.32 156.21,54.93 137.48,54.93 136.52,55.88 | 136.52,55.88 EPOLOLU.GND@0 136.52,61.47 | 136.52,61.47 C13.2 | 136.52,61.47 136.52,55.88 | 136.52,55.88 135.57,54.93 131.76,54.93 130.81,55.88 | 130.81,55.88 ZPOLOLU.GND | 130.81,61.59 130.81,55.88 | 130.81,55.88 129.86,54.93 116.84,54.93 115.57,56.2 ZPOLOLU.GND@0 | C16.2 115.7,56.01 114.62,54.93 110.81,54.93 109.85,55.88 | 109.85,55.88 YPOLOLU.GND | 109.85,61.59 109.85,55.88 | 109.85,55.88 108.9,54.93 95.25,54.93 94.61,55.56 | 94.61,55.56 YPOLOLU.GND@0 | 88.9,55.56 88.9,61.59 88.9,55.24 | 88.9,55.56 89.53,54.93 93.98,54.93 94.61,55.56 | XPOLOLU.GND@0 73.66,55.88 74.61,54.93 88.26,54.93 88.9,55.56
  Bottom 1.27: C9.2 88.9,61.59 XPOLOLU.GND | C8.2 109.85,61.59 YPOLOLU.GND | C14.2 94.61,61.59 YPOLOLU.GND@0 | C12.2 130.81,61.59 ZPOLOLU.GND | C11.2 151.76,61.59 EPOLOLU.GND | C10.2 172.72,61.59 EPOLOLU2.GND | C17.2 73.66,61.59 XPOLOLU.GND@0 | ZPOLOLU.GND@0 115.7,59.05 C16.2
  Bottom 1.422: 67.31,11.43 70.48,8.25 BEDTHERM.1 | BEDTHERM.1 70.48,5.4 BEDTHERM.1
  pour Bottom: 177.48,56.83 66.67,56.83 66.67,1.27 160.02,1.27 177.48,18.73
  pour Bottom: 0.63,56.83 65.41,56.83 65.41,0.95 18.41,0.95 0.63,18.73
MCRTS  (via drill 0.6)
  Top 0.406: IC1.11 158.75,28.57 161.29,28.57 v161.92,29.21 | v161.92,20.32 159.38,17.78 159.38,12.38 148.91,1.9 126.36,1.9 125.73,2.54 125.73,13.33 129.22,13.33 129.98,12.7 C7.2
  Bottom 0.406: v161.92,29.21 v161.92,20.32
MCRX  (via drill 0.6)
  Top 0.406: IC2.15 121.92,23.18 122.55,23.81 135.89,23.81 137.79,21.91 144.14,21.91 v146.05,23.18 | v160.02,32.07 157.8,32.07 157.48,31.75 IC1.12
  Bottom 0.406: v146.05,23.18 146.05,27.3 146.37,27.62 158.11,27.62 160.34,29.84 160.34,31.75 v160.02,32.07
MCTX  (via drill 0.6)
  Top 0.406: IC1.10 160.1,20.4 v160.34,20.64 | v160.34,24.76 121.6,24.76 119.38,22.54 IC2.14
  Bottom 0.406: v160.34,20.64 v160.34,24.76
MCURESET  (via drill 0.6)  (1 unrouted)
  Top 0.406: J2.5 78.74,30.48 100.33,30.48 R4.1 104.77,25.4 106.68,23.49 IC2.9 106.68,12.38 107.31,11.75 v123.51,11.75 | S2.1 S2.2 134.7,9.32 C7.1
  Bottom 0.406: v123.51,11.75 127,11.75 128.27,10.48 128.27,7.94
MISO
  Top 0.406: IC2.7 101.6,24.13 98.11,27.62 J2.1
MOSI
  Top 0.406: IC2.6 99.06,22.86 96.52,25.4 85.09,25.4 83.18,23.49 79.06,23.49 78.42,24.13 J2.4
N$1
  Top 0.406: IC1.2 148.59,19.05 147.32,17.78 143.83,17.78 142.87,16.83 142.87,14.29 | 142.87,14.29 Q1.1 | C2.2 142.68,14.1 142.87,14.29
N$2
  Top 0.406: IC1.3 149.86,18.41 147.95,16.51 147.95,13.97 | 147.95,13.97 Q1.2 | C1.1 148.08,14.1 147.95,13.97
N$3
  Top 0.406: IC1.5 152.4,17.14 152.72,16.83 154.62,16.83 R2.2
N$4
  Top 0.406: IC1.18 149.86,27.94 150.49,27.3 166.37,27.3 167,27.94 167,28.52 X1.D-
N$5
  Top 0.406: IC1.19 148.59,27.3 149.86,26.03 168.27,26.03 168.91,26.67 X1.D+
N$6
  Top 0.406: IC1.6 153.67,18.1 153.99,17.78 R3.2
N$7
  Top 0.406: C3.2 151,30.53 IC1.17
N$8
  Bottom 0.406: Q3.G R13.2
N$9
  Top 0.406: R2.1 165.73,15.24 LED1.K
N$10
  Top 0.406: R3.1 165.73,17.78 LED2.K
N$11
  Top 0.406: C5.1 IC2.12
  Bottom 0.61: IC2.12 114.3,26.03 117.47,29.21 Q2.1
N$12
  Top 0.406: C6.1 117.47,17.78 116.84,18.41 IC2.13
  Bottom 0.61: IC2.13 116.84,24.13 118.74,26.03 125.73,26.03 128.27,28.57 Q2.2
N$13
  Top 0.406: IC1.4 151.13,16.51 151.76,15.87 154.3,15.87 154.94,15.24 154.94,13.33 154.94,12.7 | 154.94,12.7 155.57,12.7 R1.1 | S1.3 S1.4 148.23,3.45 154.94,10.16 154.94,12.38 154.94,12.7
N$14
  Bottom 0.406: ZPOLOLU.MS1 115.57,49.53 118.11,49.53 SJ5.1 SJ6.1 122.05,49.4 122.55,48.89 122.55,47.62 127.63,47.62 128.27,48.26 R7.1 128.27,49.4
N$15
  Bottom 0.406: SJ6.2 ZPOLOLU.MS3
N$16
  Bottom 0.406: SJ5.2 ZPOLOLU.MS2
N$17
  Bottom 0.406: SJ7.2 EPOLOLU.MS2
N$18
  Bottom 0.406: SJ8.2 EPOLOLU.MS3
N$19
  Bottom 0.406: EPOLOLU.MS1 136.52,49.53 139.06,49.53 SJ7.1 SJ8.1 143,49.4 143.51,48.89 143.51,47.62 148.59,47.62 149.22,48.26 R8.1 149.22,49.4
N$20
  Bottom 0.406: SJ3.2 YPOLOLU.MS2
N$21
  Bottom 0.406: SJ4.2 YPOLOLU.MS3
N$22
  Bottom 0.406: YPOLOLU.MS1 94.61,49.53 96.52,49.53 | 96.52,49.53 97.15,49.53 SJ3.1 SJ4.1 | 99.69,49.53 96.52,49.53 | SJ4.1 99.69,49.53 | SJ4.1 99.69,49.53 | 99.69,49.53 100.96,49.53 101.6,48.89 101.6,47.62 106.68,47.62 107.31,48.26 R6.1
N$23
  Bottom 0.406: SJ1.2 XPOLOLU.MS2
N$24
  Bottom 0.406: SJ2.2 XPOLOLU.MS3
N$25
  Bottom 0.406: XPOLOLU.MS1 73.66,49.4 SJ1.1 SJ2.1 78.74,49.53 80.01,49.53 80.64,48.89 80.64,47.62 85.72,47.62 86.36,48.26 R5.1
N$26
  Bottom 1.27: XPOLOLU.SLP XPOLOLU.RST
N$27
  Bottom 1.27: YPOLOLU.RST YPOLOLU.SLP
N$28
  Bottom 1.27: ZPOLOLU.RST ZPOLOLU.SLP
N$29
  Bottom 1.27: EPOLOLU.RST EPOLOLU.SLP
N$30
  Bottom 1.27: E1MOTOR.1 EPOLOLU.2B
N$31
  Bottom 1.27: E1MOTOR.2 EPOLOLU.2A
N$32
  Bottom 1.27: E1MOTOR.3 EPOLOLU.1A
N$33
  Bottom 1.27: E1MOTOR.4 EPOLOLU.1B
N$34
  Bottom 1.27: ZMOTOR.4 ZPOLOLU.1B
N$35
  Bottom 1.27: ZMOTOR.3 ZPOLOLU.1A
N$36
  Bottom 1.27: ZMOTOR.2 ZPOLOLU.2A
N$37
  Bottom 1.27: ZMOTOR.1 118.11,59.69 ZPOLOLU.2B
N$38
  Bottom 1.27: YMOTOR.4 YPOLOLU.1B
N$39
  Bottom 1.27: YMOTOR.3 YPOLOLU.1A
N$40
  Bottom 1.27: YMOTOR.2 YPOLOLU.2A
N$41
  Bottom 1.27: YMOTOR.1 97.15,59.69 YPOLOLU.2B
N$42
  Bottom 1.27: XMOTOR.4 XPOLOLU.1B
N$43
  Bottom 1.27: XMOTOR.3 XPOLOLU.1A
N$44
  Bottom 1.27: XMOTOR.2 XPOLOLU.2A
N$45
  Bottom 1.27: XMOTOR.1 XPOLOLU.2B
N$46
  Bottom 0.406: SJ9.2 EPOLOLU2.MS2
N$47
  Bottom 0.406: SJ10.2 EPOLOLU2.MS3
N$48
  Bottom 0.406: EPOLOLU2.MS1 157.48,49.53 160.02,49.53 SJ9.1 SJ10.1 163.96,49.4 164.46,48.89 164.46,47.62 169.54,47.62 170.18,48.26 R9.1 170.18,49.4
N$49
  Bottom 1.27: EPOLOLU2.RST EPOLOLU2.SLP
N$50
  Bottom 1.27: E2MOTOR.1 EPOLOLU2.2B
N$51
  Bottom 1.27: E2MOTOR.2 162.56,59.69 EPOLOLU2.2A
N$52
  Bottom 1.27: E2MOTOR.3 EPOLOLU2.1A
N$53
  Bottom 1.27: E2MOTOR.4 EPOLOLU2.1B
N$54
  Bottom 0.61: IC2.32 106.68,31.56 C23.1
N$55  (1 unrouted)
  Top 0.406: LED5.K D1.A
  Bottom 0.406: LED5.K 49.85,62.23 48.53,60.92 43.2,60.92 43.2,62.22 42.53,62.88
  Bottom 2.54: Q3.D 42.54,55.88 42.54,57.15
  Bottom 3.81: 42.54,57.15 42.54,62.9 EXT1HEATER.1
N$56
  Bottom 0.406: Q4.G R14.2
N$57
  Top 0.406: LED6.K D2.A
  Bottom 0.406: D2.A 66.67,62.96 64.66,60.95 57.21,60.95 57.15,61.01
  Bottom 2.54: Q4.D 57.15,55.88 57.15,57.15
  Bottom 3.81: 57.15,57.15 57.15,61.01 57.15,63.54 EXT2HEATER.1
N$60  (via drill 0.6)
  Top 0.406: J1.22 8.67,28.99 8.89,28.89 | 24.26,25.9 R16.2
  Top 0.61: v24.13,12.7 24.13,26.03 R16.2
  Top 0.813: J1.21 J1.22 10.48,27.3 20.64,27.3 21.59,26.35 R16.2
  Bottom 0.61: SJ12.1 25.21,11.61 v24.13,12.7
N$61
  Top 0.406: LED5.A R18.1
N$62  (via drill 0.6)
  Top 0.406: J1.9 5.26,33.31 7.38,35.44 10.21,35.44
  Top 0.61: v28.26,12.7 28.26,16.51 30.16,18.41 30.16,24.76 29.21,25.72 29.21,29.21 28.57,29.84 R17.2
  Top 0.813: 10.21,35.44 10.6,35.44 13.65,32.38 21.27,32.38 R17.2
  Bottom 0.61: SJ11.1 28.45,12.51 v28.26,12.7
N$63
  Bottom 0.813: R17.1 34.29,29.84 34.92,29.21 LED4.A
N$64
  Bottom 0.813: R16.1 31.43,23.49 LED3.A
N$65
  Bottom 0.406: Q6.G R21.2
N$66
  Top 0.406: LED6.A R19.1
N$67  (1 unrouted)
  Top 0.406: LED8.K 36.19,66.67 34.92,67.94 27.3,67.94 26.03,66.67 26.03,64.17 FAN.1
  Bottom 2.54: Q6.D 27.34,57.4 27.24,57.94
  Bottom 3.81: 27.24,57.94 27.24,64.33 FAN.1
N$69
  Top 0.406: LED8.A R22.1
PSON  (via drill 0.6)
  Top 0.406: 133.98,33.34 132.4,33.34 131.76,32.7 116.2,32.7 112.08,28.57 104.77,28.57 101.6,31.75 v91.44,31.75 | v84.14,19.68 v75.25,19.68
  Top 0.61: IC2.21 134.62,33.97 133.98,33.34
  Bottom 0.406: v91.44,31.75 91.44,23.81 90.17,22.54 86.04,22.54 84.77,21.27 84.77,19.68 v84.14,19.68 | v75.25,19.68 65.72,19.68 65.72,2.22 51.12,2.22 49.85,2.22 37.78,14.29 12.06,14.29 10.79,15.56 10.79,17.14 9.52,18.41 6.67,18.41 6.03,19.05 6.03,52.7 7.62,54.29 8.57,54.29 | 8.57,54.29 8.89,54.29 | J1.16 8.59,54.31 8.57,54.29
SCK
  Top 0.406: J2.3 78.42,28.26 79.69,29.53 98.74,29.53 104.14,24.13 IC2.8
SCL
  Top 0.406: IC2.22 132.08,37.46 132.52,37.97 135.1,37.94 137.16,35.88 137.79,35.24 141.29,35.24 141.92,35.88 JP2.2
SDA
  Top 0.406: IC2.23 129.54,38.1 130.17,38.73 139.06,38.73 139.38,38.42 JP2.1
SDS
  Top 0.406: JP1.4 132.08,16.83 134.62,19.37 IC2.20
VCC  (via drill 0.6)  (1 unrouted)
  Top 0.406: R9.2 170.18,55.88 v172.72,53.34 151.13,53.34 | v177.16,53.34 177.16,43.81 173.35,40 173.35,38.73 174.62,37.46 174.62,34.29 | 174.62,34.29 173.99,33.65 173.35,33.65 172.72,33.02 167.64,33.02 167,32.38 167,31.11 166.95,31.11 X1.VBUS | R1.2 168.59,12.7 169.54,13.65 LED1.A LED2.A 169.54,21.27 168.91,21.91 | 168.91,21.91 160.97,21.91 159.7,23.18 148.27,23.18 147.32,22.22 147.32,20.32 | 147.32,20.32 IC1.1 | 168.91,21.91 169.23,21.91 170.18,20.95 173.67,20.95 174.62,21.91 174.62,34.29 | IC2.10 109.22,22.86 R4.2 137.16,26.03 v138.43,27.3 | v140.65,19.78 147.32,20.32 | 149.22,55.24 151.13,53.34 | R7.2 128.27,54.93 129.86,53.34 | 129.86,53.34 151.13,53.34 | 128.14,57.28 128.14,55.05 129.86,53.34 | 129.86,53.34 109.22,53.34 | 109.22,53.34 107.31,55.24 | 107.31,55.24 R6.2 107.31,55.24 | 107.31,55.24 109.22,53.34 | 109.22,53.34 87.95,53.34 86.36,54.93 R5.2
  Top 0.61: v16.83,12.7 X6.1 | v41.27,7.94 41.27,13.02 C30.+
  Bottom 0.406: C10.1 170.05,57.28 R9.2 | C11.1 149.1,57.28 R8.2 | C12.1 128.14,57.28 R7.2 | J2.2 81.28,19.68 XENDSTOP.1 | v172.72,53.34 176.53,53.34 v177.16,53.34 | C4.1 163.73,34.29 X1.VBUS | v138.43,27.3 L1.2 140.65,21.91 v140.65,19.78
  Bottom 0.61: v16.83,12.7 16.83,11.43 18.1,10.16 SJ12.2 24.31,8.39 24.76,7.94 26.99,7.94 27.3,8.25 27.3,10.03 SJ11.2 27.43,8.13 27.62,7.94 v41.27,7.94
  Bottom 0.813: X6.1 13.33,19.68 12.38,20.64 12.38,42.23 14.29,44.13 X5.1
  Bottom 1.27: C9.1 86.36,61.59 XPOLOLU.VDD R5.2 | C12.1 128.27,61.59 ZPOLOLU.VDD R7.2 | C11.1 149.22,61.59 EPOLOLU.VDD R8.2 | C10.1 170.18,61.59 EPOLOLU2.VDD R9.2 | YPOLOLU.VDD R6.2
  pour Top: 21.59,0.63 160.34,0.95 177.8,18.41 177.8,56.83 21.59,56.83
VMOT
  Top 0.406: R22.2 30.48,62.23 30.48,64.13 FAN.2 | R18.2 45.72,62.23 45.72,64.13 EXT1HEATER.2 | R19.2 60.96,63.5 60.96,64.13 EXT2HEATER.2
  Bottom 0.406: C13.1 133.86,62.36 | C15.1 154.81,61.72 | XPOLOLU.VMOT 71.12,61.47 C17.1
  Bottom 0.813: X6.4 21.27,34.92 24.45,31.75 42.23,31.75 45.4,28.57 C25.+
  Bottom 1.27: 154.94,61.59 C15.1 154.94,61.47 EPOLOLU2.VMOT | 113.03,61.59 C16.1 113.03,61.47 ZPOLOLU.VMOT | EPOLOLU.VMOT 133.98,61.47 C13.1 | YPOLOLU.VMOT 92.71,60.96 92.71,61.59 C14.1
  pour Bottom: 0.95,58.42 177.17,58.42 177.17,73.02 0.95,73.02
  pour Top: 0.63,69.21 20.64,69.21 20.64,0.95 20.32,0.63 18.41,0.63 0.63,18.1
XDIR
  Top 0.406: IC2.37 93.98,40.64 88.9,45.72 XPOLOLU.DIR
XEND
  Top 0.406: XENDSTOP.3 100.33,6.98 99.06,8.25 96.52,8.25 86.36,18.41 IC2.1
XSTEP
  Top 0.406: IC2.38 91.44,40.64 86.36,45.72 XPOLOLU.STEP
YDIR
  Top 0.406: IC2.35 99.69,36.83 106.04,43.18 109.85,43.18 YPOLOLU.DIR
YEND
  Top 0.406: YENDSTOP.3 111.76,8.25 110.49,9.52 97.15,9.52 88.9,17.78 IC2.2
YSTEP
  Top 0.406: IC2.36 97.15,36.83 104.77,44.45 107.31,44.45 YPOLOLU.STEP
ZDIR
  Top 0.406: IC2.28 116.84,37.46 117.47,38.1 122.55,38.1 123.19,38.73 123.19,41.27 125.73,43.81 130.17,43.81 130.81,44.45 ZPOLOLU.DIR
ZEND
  Top 0.406: ZENDSTOP.3 123.19,9.52 121.92,10.79 97.79,10.79 91.44,17.14 IC2.3
ZSTEP
  Top 0.406: IC2.29 114.3,36.83 116.84,39.37 119.38,39.37 121.28,39.37 121.92,40 121.92,41.91 125.09,45.08 127.63,45.08 128.27,45.72 ZPOLOLU.STEP

### Text on the board
tPlace: FAN | EXT1 | EXT2 | X-Motor | Y-Motor | Z-Motor | E1-Motor | E2-Motor | 1n4004 | 1n4004 | 1n4004 | 0.1u | 0.1u | 0.1u | 0.1u | 0.1u | 0.1u | 0.1u | 0.1u | 0.1u | 0.1u | 560R | 560R | 560R | 1K | 1K | 1K | Z | 1K | E1 | E2 | 1K | X | Y | 10R | 10R | 10R | OPENHARDWARE.CO.ZA | I2C | 4K7 | 4K7 | 4K7 | 0.1u | 0.1u | 0.1u | + | + | + | 0.1u | 1K | 10u | 10u | 10u | + | MCP2200 | USB | 1K | 10K | 20MHZ | 10uH | + | SPI | NB: Place PSU Connectors on the BACK and solder on FRONT | 100u | 100u | 0.1u | 1K | 22p | 12MHZ | 22p | BED | ENC | SDS | 1K | 22p | 22p | RX/TX | 10K | 0.1u | BED | E1 | E2 | XEND | YEND | ZEND | /home/peter/Desktop/logooh.bmp | Thermistor | RESET | USB-RST
bPlace: NB: Place PSU Connectors on the BACK and solder on FRONT | ATX | Molex | MS = Default 1/16th | MS | MS | MS | MS | MS | Molex | VCC Select | /home/peter/Desktop/logooh.bmp
tTest: Hotend here | Optional: 12v Fan | Pointed at printed part (for PLA) | Optional | BLACK | GREEN | BLUE | RED | BLACK | GREEN | BLUE | RED | BLACK | GREEN | BLUE | RED | Optional | BLACK | GREEN | BLUE | RED | N/O | N/O | N/O | Bed | COM | COM | COM | Hotend | Connector for LCD board use | But you could wire up your own Mosfet | from it. Left pin = Signal, Right = GND | do not connect | do not connect | do not connect